# Altium schematic sheet Step-Down converter.SchDoc
size A3; SheetNumber: 3; SheetTotal: 7
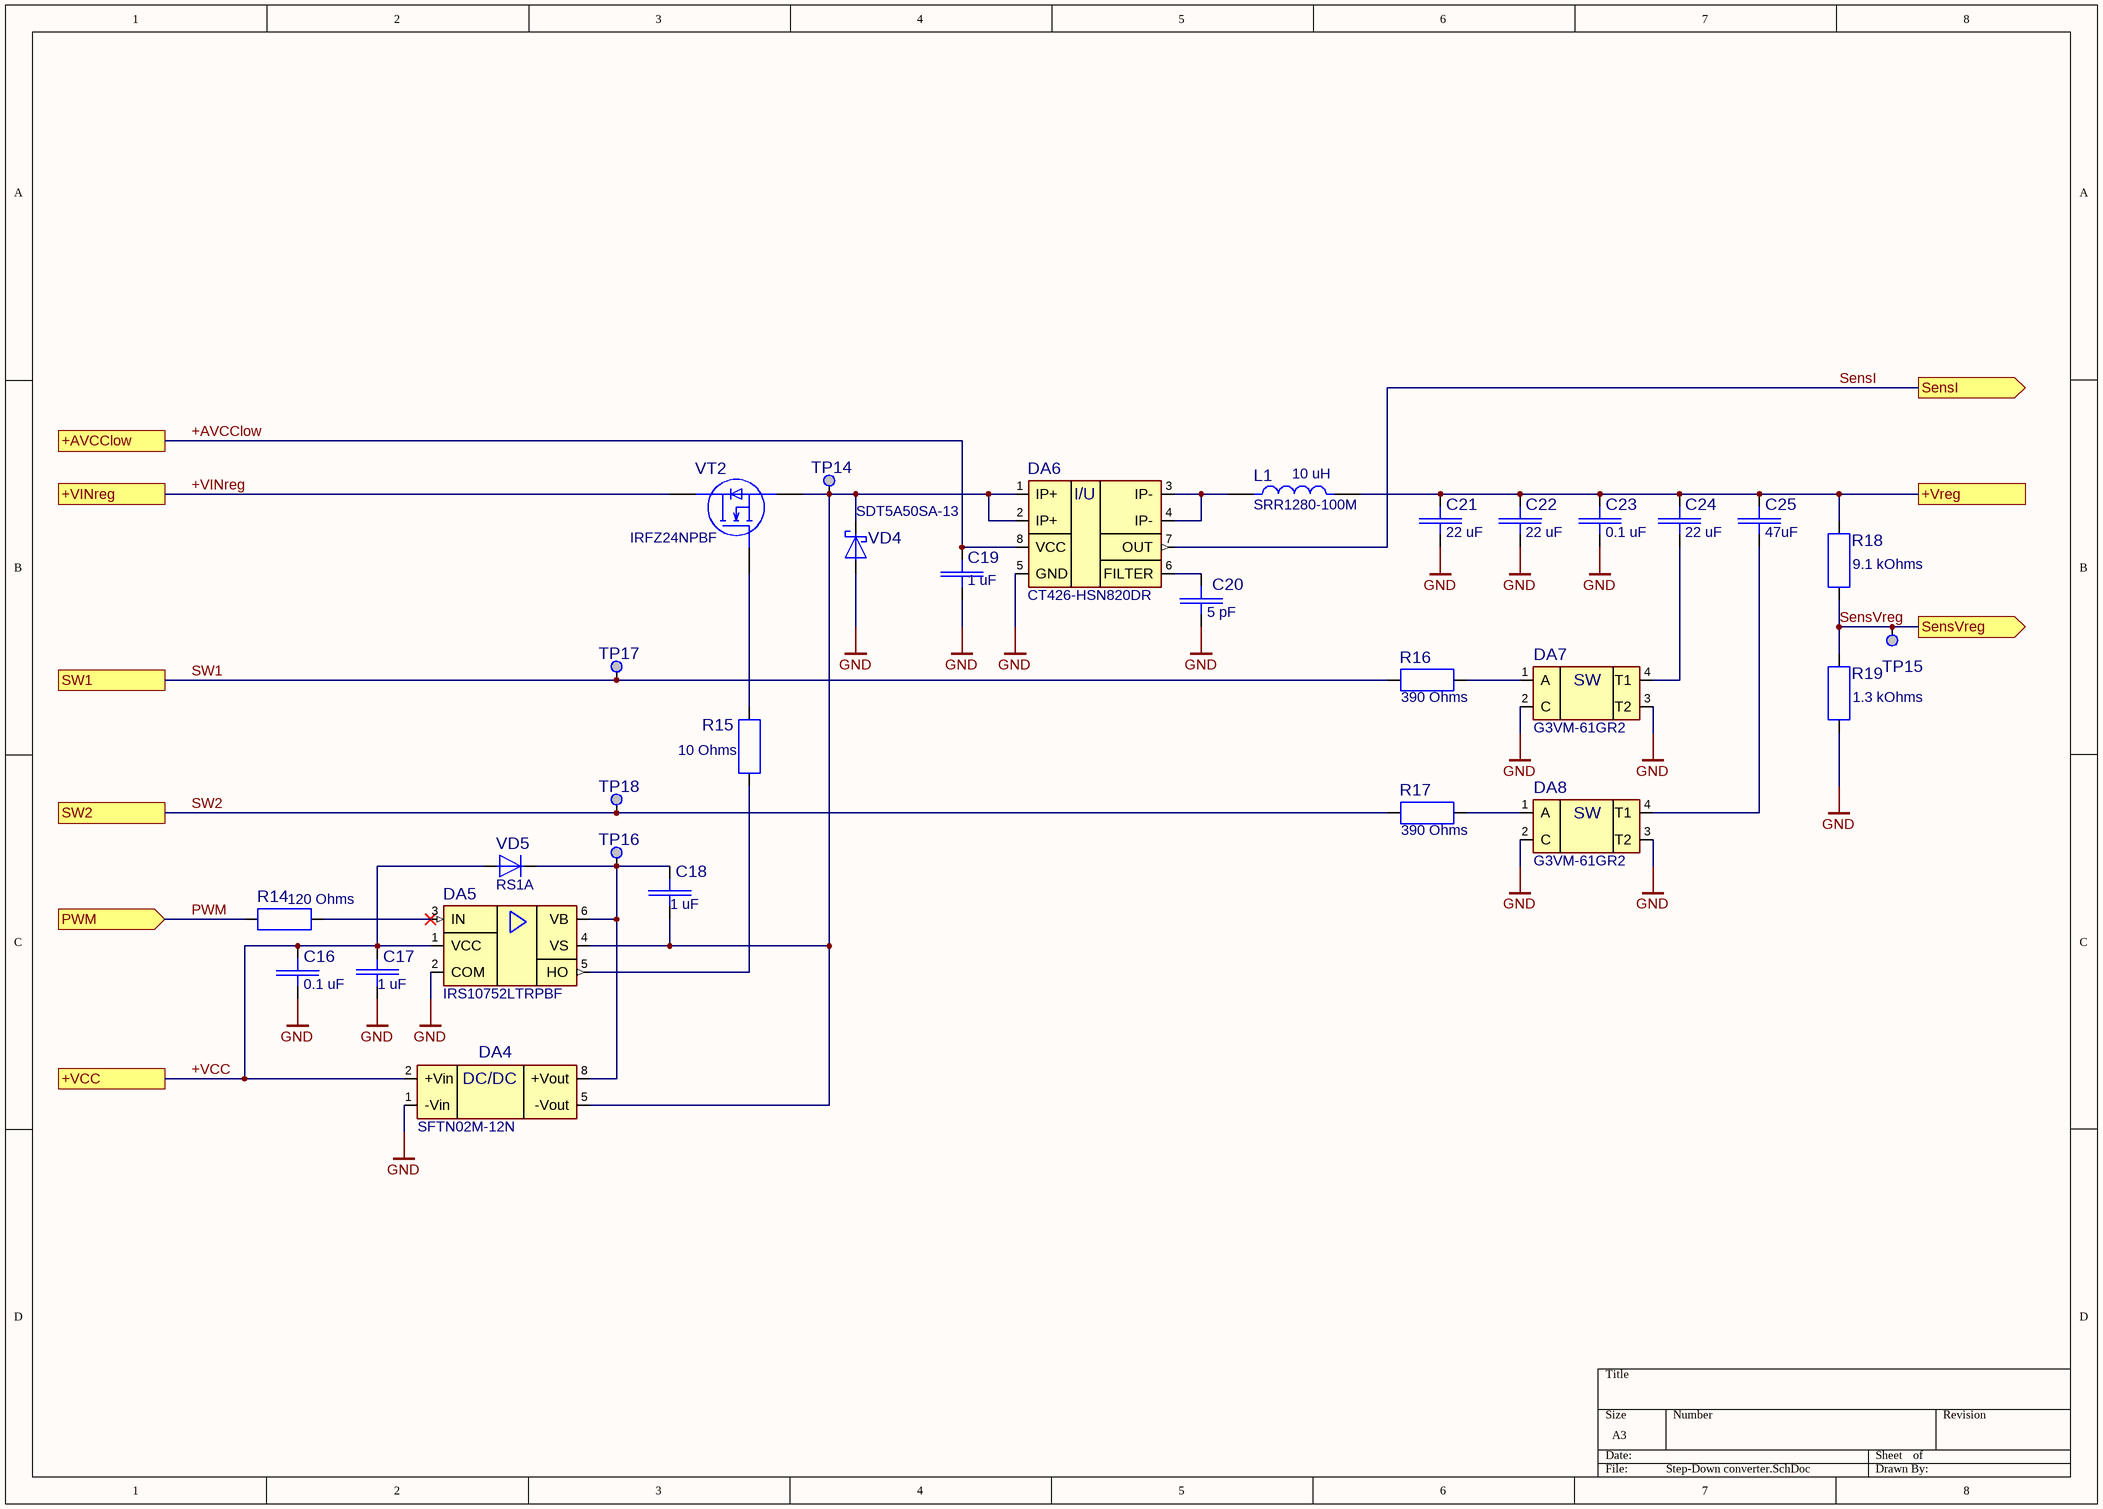
[diagram p0: Step-Down converter.SchDoc]

## Parts
C16  value 0.1 uF  [Capacitor0805_THICKNESS0.8]  (hidden comment: CL21B104KBCNNWC)
C17  value 1 uF  [Capacitor0805_THICKNESS1.25]  (hidden comment: CL21B105KAFNFNE)
C18  value 1 uF  [Capacitor0805_THICKNESS1.25]  (hidden comment: CL21B105KAFNFNE)
C19  value 1 uF  [Capacitor0805_THICKNESS1.25]  (hidden comment: CL21B105KAFNFNE)
C20  value 5 pF  [Capacitor0805_THICKNESS0.6]  (hidden comment: CC0805CRNPO9BN5R0)
C21  value 22 uF  [Capacitor1206_THICKNESS1.6]  (hidden comment: C3216X5R1V226M160AC)
C22  value 22 uF  [Capacitor1206_THICKNESS1.6]  (hidden comment: C3216X5R1V226M160AC)
C23  value 0.1 uF  [Capacitor0805_THICKNESS0.8]  (hidden comment: CL21B104KBCNNWC)
C24  value 22 uF  [Capacitor1206_THICKNESS1.6]  (hidden comment: C3216X5R1V226M160AC)
C25  value 47uF  [Capacitor2220_THICKNESS3.1]  (hidden comment: C5750X7R1V476M230KC)
DA4  SFTN02M-12N  [SFTN02-N]
DA5  IRS10752LTRPBF  [SOT23 6pin]
DA6  CT426-HSN820DR  [SOIC-8]
DA7  G3VM-61GR2  [SOP-4]
DA8  G3VM-61GR2  [SOP-4]
L1  SRR1280-100M  value 10 uH  [SRR1280-100M]
R14  value 120 Ohms  [Resistor0805_THICKNESS0.6]  (hidden comment: RC0805FR-07120RL)
R15  value 10 Ohms  [Resistor0805_THICKNESS0.6]  (hidden comment: RE0805FRE0710RL)
R16  value 390 Ohms  [Resistor0805_THICKNESS0.6]  (hidden comment: RC0805FR-07390RL)
R17  value 390 Ohms  [Resistor0805_THICKNESS0.6]  (hidden comment: RC0805FR-07390RL)
R18  value 9.1 kOhms  [Resistor0805_THICKNESS0.6]  (hidden comment: RC0805FR-079K1L)
R19  value 1.3 kOhms  [Resistor0805_THICKNESS0.6]  (hidden comment: RC0805FR-101K3L)
TP14  test point  [test point]  (value not drawn)
TP15  test point  [test point]  (value not drawn)
TP16  test point  [test point]  (value not drawn)
TP17  test point  [test point]  (value not drawn)
TP18  test point  [test point]  (value not drawn)
VD4  SDT5A50SA-13  [RS1A_CASE_SMA 403AE]
VD5  RS1A  [RS1A_CASE_SMA 403AE]
VT2  IRFZ24NPBF  [IRFZ24NPBF TO-220 with HS FA-T220-64E]

## Ports
+AVCClow (see NGI_Search2[4C], Regulate load2[1B]), +VCC (see NGI_Search2[4C]), +VINreg (see NGI_Search2[4C]), +Vreg (see NGI_Search2[5C]), PWM (in, see NGI_Search2[4C]), SensI (out, see NGI_Search2[5C]), SensVreg (out, see NGI_Search2[5C]), SW1 (see NGI_Search2[4C]), SW2 (see NGI_Search2[4C])

## Nets
GND: C16.1 C17.2 C19.1 C20.1 C21.1 C22.1 C23.1 DA4.1(-Vin) DA5.2(COM) DA6.5(GND) DA7.2(C) DA7.3(T2) DA8.2(C) DA8.3(T2) R19.1 VD4.A
+AVCClow: C19.2 DA6.8(VCC) ; port +AVCClow
+VCC: C16.2 C17.1 DA4.2(+Vin) DA5.1(VCC) VD5.A ; port +VCC
+VINreg: VT2.2(D) ; port +VINreg
+Vreg: C21.2 C22.2 C23.2 C24.2 C25.2 L1.2 R18.2 ; port +Vreg
PWM: R14.1 ; port PWM
SensI: DA6.7(OUT) ; port SensI
SensVreg: R18.1 R19.2 TP15.1 ; port SensVreg
SW1: R16.1 TP17.1 ; port SW1
SW2: R17.1 TP18.1 ; port SW2
NetC18_1: C18.1 DA4.5(-Vout) DA5.4(VS) DA6.1(IP+) DA6.2(IP+) TP14.1 VD4.C VT2.3(S)
NetC18_2: C18.2 DA4.8(+Vout) DA5.6(VB) TP16.1 VD5.C
NetC20_2: C20.2 DA6.6(FILTER)
NetC24_1: C24.1 DA7.4(T1)
NetC25_1: C25.1 DA8.4(T1)
NetDA5_3: DA5.3(IN) R14.2
NetDA5_5: DA5.5(HO) R15.1
NetDA6_3: DA6.3(IP-) DA6.4(IP-) L1.1
NetDA7_1: DA7.1(A) R16.2
NetDA8_1: DA8.1(A) R17.2
NetR15_2: R15.2 VT2.1(G)

Not connected (* = marked no-connect by the designer): DA4 3(N.C.) 6(N.C.) 7(N.C.) 10(N.C.) 11(N.C.) 12(N.C.)

## Notes on the sheet
- (in symbol CT426-HSN820DR) I/U
- (in symbol G3VM-61GR2) SW
- (in symbol SFTN02M-12N) DC/DC

## Library data of the parts
C16 C23 = CL21B104KBCNNWC: Multilayer Ceramic Capacitors MLCC - SMD/SMT 100nF+/-10% 50V X7R 0805; Manufacturer: Samsung Electro-Mechanics; Tolerance: 10%; Dielectric: X7R; ManufacturerPartNumber: CL21B104KBCNNWC; Mouser Price/Stock: https://eu.mouser.com/ProductDetail/Samsung-Electro-Mechanics/CL21B104KBCNNWC?qs=yOVawPpwOwlu2UTVxWhmlw%3D%3D; Power/Voltage: 50V; Case: 0805; Datasheet Link: https://eu.mouser.com/datasheet/2/585/MLCC-1837944.pdf; Mouser Part Number: 187-CL21B104KBCNNWC
C17-C19 = CL21B105KAFNFNE: Multilayer Ceramic Capacitors MLCC - SMD/SMT 1uF+/-10% 25V X7R 20 0805; Manufacturer: Samsung Electro-Mechanics; Tolerance: 10%; Case: 0805; Datasheet Link: https://eu.mouser.com/datasheet/2/585/MLCC-1837944.pdf; Dielectric: X7R; ManufacturerPartNumber: CL21B105KAFNFNE; Mouser Part Number: 187-CL21B105KAFNFNE; Mouser Price/Stock: https://eu.mouser.com/ProductDetail/Samsung-Electro-Mechanics/CL21B105KAFNFNE?qs=%252B6g0mu59x7LIqMOGGtEcpA%3D%3D; Power/Voltage: 25V
C20 = CC0805CRNPO9BN5R0: Multilayer Ceramic Capacitors MLCC - SMD/SMT 50V 5pF C0G 0805 Tol 0.25pF; Manufacturer: YAGEO; Dielectric: C0G (NP0); Tolerance: 5%; Case: 0805; Datasheet Link: https://eu.mouser.com/datasheet/2/447/UPY_NP0X5R_01005_4V_to_25V_V10-3003057.pdf; ManufacturerPartNumber: CC0805CRNPO9BN5R0; Mouser Part Number: 603-CC805CRNPO9BN5R0; Mouser Price/Stock: https://eu.mouser.com/ProductDetail/YAGEO/CC0805CRNPO9BN5R0?qs=57cj7OiSijm1o7wMqGKW1g%3D%3D; Power/Voltage: 50V
C21 C22 C24 = C3216X5R1V226M160AC: Multilayer Ceramic Capacitors MLCC - SMD/SMT 1206 35V 22uF X5R 20% T: 1.6mm; Manufacturer: TDK; Case: 1206; Datasheet Link: https://product.tdk.com/system/files/dam/doc/product/capacitor/ceramic/mlcc/catalog/mlcc_commercial_general_en.pdf; Dielectric: X5R; ManufacturerPartNumber: C3216X5R1V226M160AC; Mouser Part Number: 810-C3216X5R1V226M; Mouser Price/Stock: https://eu.mouser.com/ProductDetail/TDK/C3216X5R1V226M160AC?qs=NRhsANhppD8TwN31eZ1xGQ%3D%3D; Power/Voltage: 35V; Tolerance: 20%
C25 = C5750X7R1V476M230KC: Multilayer Ceramic Capacitors MLCC - SMD/SMT 2220 35VDC 47uF 20% X7R; Manufacturer: TDK; Power/Voltage: 35V; Case: 2220; Datasheet Link: https://product.tdk.com/system/files/dam/doc/product/capacitor/ceramic/mlcc/catalog/mlcc_commercial_general_en.pdf; Dielectric: X7R; ManufacturerPartNumber: C5750X7R1V476M230KC; Mouser Part Number: 810-C5750X7R1V476M23; Mouser Price/Stock: https://eu.mouser.com/ProductDetail/TDK/C5750X7R1V476M230KC?qs=rSMjJ%252B1ewcSIfs95ZgB3Sw%3D%3D; Tolerance: 20%
DA4 = SFTN02M-12N: Isolated DC/DC Converters - SMD 2W 12Vin 12Vout 33-167mA SMT Unregulated; Manufacturer: MEAN WELL; Case: SFTN02-N; Datasheet Link: https://www.meanwell.com/webapp/product/search.aspx?prod=SFTN02-N; ManufacturerPartNumber: SFTN02M-12N; Mouser Part Number: 709-SFTN02M-12N; Mouser Price/Stock: https://eu.mouser.com/ProductDetail/MEAN-WELL/SFTN02M-12N?qs=A6eO%252BMLsxmT1hTQp3VGaXQ%3D%3D
DA5 = IRS10752LTRPBF: Gate Drivers Hi Side Gate Driver Single Channel; Manufacturer: Infineon; Case: SOT-23 6pin; Datasheet Link: https://eu.mouser.com/datasheet/2/196/Infineon_IRS10752L_DS_v01_02_EN-3363637.pdf; ManufacturerPartNumber: IRS10752LTRPBF; Mouser Part Number: 942-IRS10752LTRPBF; Mouser Price/Stock: https://eu.mouser.com/ProductDetail/Infineon-Technologies/IRS10752LTRPBF?qs=17WaC%252BZOsuKXVNmF3l6MAw%3D%3D
DA6 = CT426-HSN820DR: Board Mount Current Sensors XtremeSense TMR Ultra-Low Noise, 8-lead SOIC (20 ADC; VDD = 3.3 V; Up to +125C); Manufacturer: Crocus Technology; Case: SOIC-8; Datasheet Link: https://eu.mouser.com/datasheet/2/779/CT426_Data_Sheet_Rev0_7-2934570.pdf; ManufacturerPartNumber: CT426-HSN820DR; Mouser Part Number: 462-CT426-HSN820DR; Mouser Price/Stock: https://eu.mouser.com/ProductDetail/Crocus/CT426-HSN820DR?qs=7D1LtPJG0i3u5AJ0mZ7fbw%3D%3D
DA7 DA8 = G3VM-61GR2: Solid State Relays - PCB Mount 60V,1.7A, 80mOhm ONr 1 Form A, SOP4/SMT; Manufacturer: Omron; Case: SOP-4; Datasheet Link: https://eu.mouser.com/datasheet/2/307/en-g3vm_61gr2-780127.pdf; ManufacturerPartNumber: G3VM-61GR2; Mouser Part Number: 653-G3VM61GR2; Mouser Price/Stock: https://eu.mouser.com/ProductDetail/Omron-Electronics/G3VM-61GR2?qs=ycOx5YLpuFVseArz%252BUpyOA%3D%3D
L1 = SRR1280-100M: Power Inductors - SMD 10uH 20% SMD 1280; Manufacturer: Bourns; Maximum Current: 6 A; Maximum Resistance: 19.5 mOhms; Case: 5050; Datasheet Link: https://eu.mouser.com/datasheet/2/54/srr1280-1391363.pdf; ManufacturerPartNumber: SRR1280-100M; Mouser Part Number: 652-SRR1280-100M; Mouser Price/Stock: https://eu.mouser.com/ProductDetail/Bourns/SRR1280-100M?qs=brMhP%2FMjUfe%2FtbNTKcGHiQ%3D%3D; Tolerance: 20%
R14 = RC0805FR-07120RL: Thick Film Resistors 120 Ohms 125 mW 0805 1%; Manufacturer: YAGEO; Power/Voltage: 125 mW / 150V; ManufacturerPartNumber: RC0805FR-07120RL; Tolerance: 1%; Case: 0805; Mouser Price/Stock: https://eu.mouser.com/ProductDetail/YAGEO/RC0805FR-07120RL?qs=sGAEpiMZZMvdGkrng054t8Tx25L%252BvTaRzcdZIgz1A9Y%3D; Datasheet Link: https://eu.mouser.com/datasheet/2/447/YAGEO_PYu_RC_Group_51_RoHS_L_12-3313492.pdf; Mouser Part Number: 603-RC0805FR-07120RL
R15 = RE0805FRE0710RL: Thick Film Resistors 10 Ohms 125 mW 0805 1%; Manufacturer: YAGEO; Power/Voltage: 125 mW / 150V; Case: 0805; Datasheet Link: https://eu.mouser.com/datasheet/2/447/PYu_RE_105_RoHS_L_6-3003059.pdf; ManufacturerPartNumber: RE0805FRE0710RL; Mouser Part Number: 603-RE0805FRE0710RL; Mouser Price/Stock: https://eu.mouser.com/ProductDetail/YAGEO/RE0805FRE0710RL?qs=sGAEpiMZZMvdGkrng054txKsa61JPVaKU6lpEP28x7tdTAAdaUzZLA%3D%3D; Tolerance: 1%
R16 R17 = RC0805FR-07390RL: Thick Film Resistors 390 Ohms 125 mW 0805 1%; Manufacturer: YAGEO; Power/Voltage: 125 mW / 150V; Case: 0805; Datasheet Link: https://eu.mouser.com/datasheet/2/447/YAGEO_PYu_RC_Group_51_RoHS_L_12-3313492.pdf; ManufacturerPartNumber: RC0805FR-07390RL; Mouser Part Number: 603-RC0805FR-07390RL; Mouser Price/Stock: https://eu.mouser.com/ProductDetail/YAGEO/RC0805FR-07390RL?qs=sGAEpiMZZMvdGkrng054txsj74Bdh5mga79f2h4RYlI%3D; Tolerance: 1%
R18 = RC0805FR-079K1L: Thick Film Resistors 9.1 kOhms 125 mW 0805 1%; Manufacturer: YAGEO; Power/Voltage: 125 mW / 150V; ManufacturerPartNumber: RC0805FR-079K1L; Tolerance: 1%; Case: 0805; Mouser Price/Stock: https://eu.mouser.com/ProductDetail/YAGEO/RC0805FR-079K1L?qs=sGAEpiMZZMvdGkrng054t8AJgcdMkx7xQsgCDGWWsX0%3D; Datasheet Link: https://eu.mouser.com/datasheet/2/447/YAGEO_PYu_RC_Group_51_RoHS_L_12-3313492.pdf; Mouser Part Number: 603-RC0805FR-079K1L
R19 = RC0805FR-101K3L: Thick Film Resistors 1.3 kOhms 250 mW 0805 1%; Manufacturer: YAGEO; Power/Voltage: 250 mW / 150V; ManufacturerPartNumber: RC0805FR-101K3; Tolerance: 1%; Case: 0805; Mouser Price/Stock: https://eu.mouser.com/ProductDetail/YAGEO/RC0805FR-101K3L?qs=sGAEpiMZZMvdGkrng054tyq4809kW%252ByTH4crGNSozBI%3D; Datasheet Link: https://eu.mouser.com/datasheet/2/447/PYu_RC_Group_51_RoHS_L_11-1984063.pdf; Mouser Part Number: 603-RC0805FR-101K3L
VD4 = SDT5A50SA-13: Schottky Diodes & Rectifiers Schottky Rectifier; Manufacturer: Diodes Incorporated; Case: SMA (DO-214AC); Datasheet Link: https://eu.mouser.com/datasheet/2/115/DIOD_S_A0006646692_1-2542970.pdf; ManufacturerPartNumber: SDT5A50SA-13; Mouser Part Number: 621-SDT5A50SA-13; Mouser Price/Stock: https://eu.mouser.com/ProductDetail/Diodes-Incorporated/SDT5A50SA-13?qs=PqoDHHvF648Tl3iEGgSrjg%3D%3D
VD5 = RS1A: Rectifiers 50V 1a Fast Rect SMa; Manufacturer: onsemi; ManufacturerPartNumber: RS1A; Mouser Price/Stock: https://eu.mouser.com/ProductDetail/onsemi-Fairchild/RS1A?qs=sGAEpiMZZMutXGli8Ay4kAXd892%252BOdvfjQsX8ptTDkM%3D; Case: SMA 403AE; Datasheet Link: https://eu.mouser.com/datasheet/2/308/1/RS1M_D-2320127.pdf; Mouser Part Number: 512-RS1A
VT2 = IRFZ24NPBF: MOSFT 55V 17A 70mOhm 13.3nC; Manufacturer: Infineon; Case: TO-220; Datasheet Link: https://eu.mouser.com/datasheet/2/196/Infineon_IRFZ24N_DataSheet_v01_01_EN-3363353.pdf; ManufacturerPartNumber: IRFZ24NPBF; Mouser Part Number: 942-IRFZ24NPBF; Mouser Price/Stock: https://eu.mouser.com/ProductDetail/Infineon-Technologies/IRFZ24NPBF?qs=9%252BKlkBgLFf0TQgSTtY4J0g%3D%3D